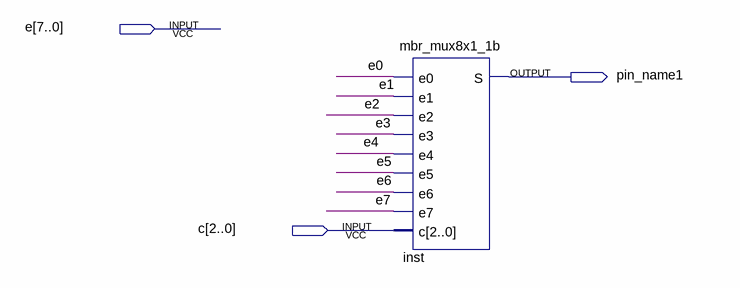
[diagram p0: schematic sheet]
// Quartus schematic teste_mux8x1.bdf as structural Verilog: 1 symbols, 3 pins
module teste_mux8x1 (
  input  [7:0] e,
  input  [2:0] c,
  output pin_name1
);

  mbr_mux8x1_1b inst (
    .e0(e[0]), .e1(e[1]), .e2(e[2]), .e3(e[3]), .e4(e[4]), .e5(e[5]), .e6(e[6]), .e7(e[7]), .c(c),
    .S(pin_name1));
endmodule
